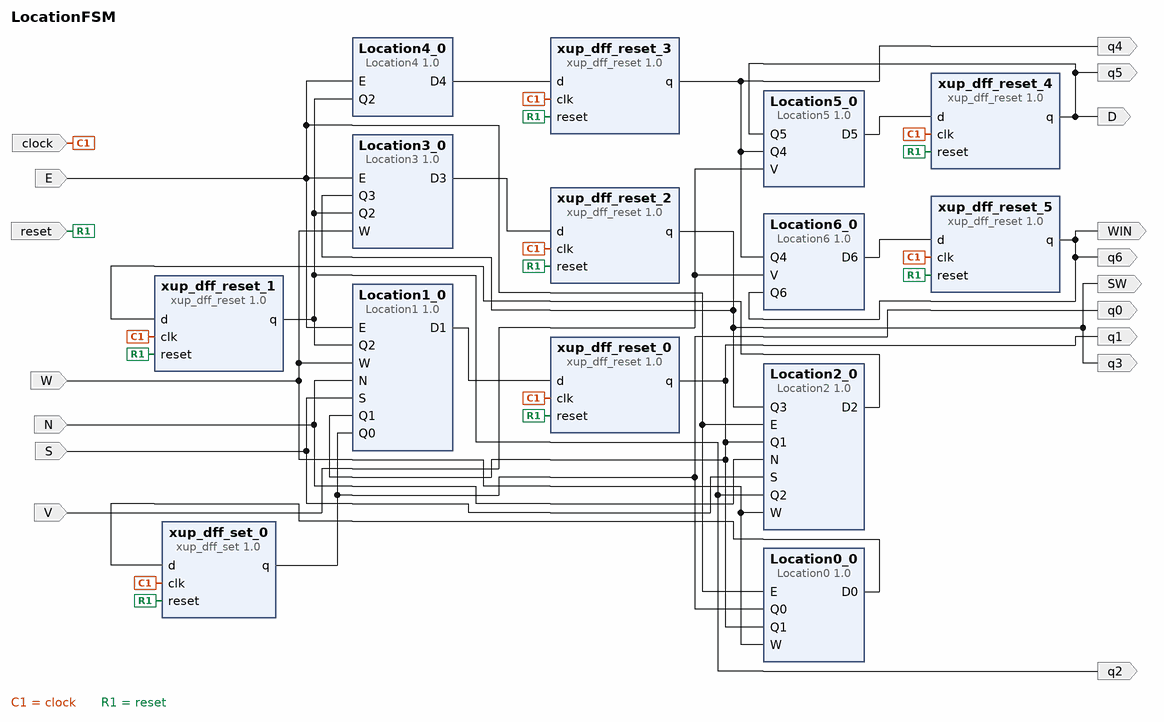
[diagram p0: block diagram of the top level]
# Vivado block design LocationFSM, xc7a100tcsg324-1, Vivado 2021.2
create_bd_design LocationFSM

create_bd_port -dir I E
create_bd_port -dir I N
create_bd_port -dir I S
create_bd_port -dir I W
create_bd_port -dir I V
create_bd_port -dir O q0
create_bd_port -dir O q1
create_bd_port -dir O q2
create_bd_port -dir O q3
create_bd_port -dir O SW
create_bd_port -dir O q4
create_bd_port -dir O q5
create_bd_port -dir O D
create_bd_port -dir O WIN
create_bd_port -dir O q6
create_bd_port -dir I clock
create_bd_port -dir I reset

create_bd_cell -type ip -vlnv xilinx.com:user:Location0:1.0 Location0_0
create_bd_cell -type ip -vlnv xilinx.com:user:Location1:1.0 Location1_0
create_bd_cell -type ip -vlnv xilinx.com:user:Location2:1.0 Location2_0
create_bd_cell -type ip -vlnv xilinx.com:user:Location3:1.0 Location3_0
create_bd_cell -type ip -vlnv xilinx.com:user:Location4:1.0 Location4_0
create_bd_cell -type ip -vlnv xilinx.com:user:Location5:1.0 Location5_0
create_bd_cell -type ip -vlnv xilinx.com:user:Location6:1.0 Location6_0
create_bd_cell -type ip -vlnv xilinx.com:user:xup_dff_reset:1.0 xup_dff_reset_0
create_bd_cell -type ip -vlnv xilinx.com:user:xup_dff_reset:1.0 xup_dff_reset_1
create_bd_cell -type ip -vlnv xilinx.com:user:xup_dff_reset:1.0 xup_dff_reset_2
create_bd_cell -type ip -vlnv xilinx.com:user:xup_dff_reset:1.0 xup_dff_reset_3
create_bd_cell -type ip -vlnv xilinx.com:user:xup_dff_reset:1.0 xup_dff_reset_4
create_bd_cell -type ip -vlnv xilinx.com:user:xup_dff_reset:1.0 xup_dff_reset_5
create_bd_cell -type ip -vlnv xilinx.com:user:xup_dff_set:1.0 xup_dff_set_0

# ---- connections ----

connect_bd_net [get_bd_ports E] \
  [get_bd_pins Location1_0/E] [get_bd_pins Location2_0/E] [get_bd_pins Location0_0/E] [get_bd_pins Location3_0/E] \
  [get_bd_pins Location4_0/E]
connect_bd_net [get_bd_pins Location0_0/D0] [get_bd_pins xup_dff_set_0/d]
connect_bd_net [get_bd_pins Location1_0/D1] [get_bd_pins xup_dff_reset_0/d]
connect_bd_net [get_bd_pins Location2_0/D2] [get_bd_pins xup_dff_reset_1/d]
connect_bd_net [get_bd_pins Location3_0/D3] [get_bd_pins xup_dff_reset_2/d]
connect_bd_net [get_bd_pins Location4_0/D4] [get_bd_pins xup_dff_reset_3/d]
connect_bd_net [get_bd_pins Location5_0/D5] [get_bd_pins xup_dff_reset_4/d]
connect_bd_net [get_bd_pins Location6_0/D6] [get_bd_pins xup_dff_reset_5/d]
connect_bd_net [get_bd_ports N] [get_bd_pins Location1_0/N] [get_bd_pins Location2_0/N]
connect_bd_net [get_bd_ports S] [get_bd_pins Location1_0/S] [get_bd_pins Location2_0/S]
connect_bd_net [get_bd_ports V] [get_bd_pins Location6_0/V] [get_bd_pins Location5_0/V]
connect_bd_net [get_bd_ports W] [get_bd_pins Location0_0/W] [get_bd_pins Location1_0/W] [get_bd_pins Location2_0/W] [get_bd_pins Location3_0/W]
connect_bd_net [get_bd_ports clock] \
  [get_bd_pins xup_dff_reset_0/clk] [get_bd_pins xup_dff_reset_1/clk] [get_bd_pins xup_dff_reset_2/clk] \
  [get_bd_pins xup_dff_reset_3/clk] [get_bd_pins xup_dff_reset_5/clk] [get_bd_pins xup_dff_set_0/clk] \
  [get_bd_pins xup_dff_reset_4/clk]
connect_bd_net [get_bd_ports reset] \
  [get_bd_pins xup_dff_reset_0/reset] [get_bd_pins xup_dff_reset_1/reset] [get_bd_pins xup_dff_reset_2/reset] \
  [get_bd_pins xup_dff_reset_3/reset] [get_bd_pins xup_dff_reset_5/reset] [get_bd_pins xup_dff_reset_4/reset] \
  [get_bd_pins xup_dff_set_0/reset]
connect_bd_net [get_bd_pins xup_dff_reset_0/q] \
  [get_bd_ports q1] [get_bd_pins Location2_0/Q1] [get_bd_pins Location1_0/Q1] [get_bd_pins Location0_0/Q1]
connect_bd_net [get_bd_pins xup_dff_reset_1/q] \
  [get_bd_ports q2] [get_bd_pins Location2_0/Q2] [get_bd_pins Location3_0/Q2] [get_bd_pins Location4_0/Q2] \
  [get_bd_pins Location1_0/Q2]
connect_bd_net [get_bd_pins xup_dff_reset_2/q] [get_bd_ports q3] [get_bd_pins Location3_0/Q3] [get_bd_pins Location2_0/Q3] [get_bd_ports SW]
connect_bd_net [get_bd_pins xup_dff_reset_3/q] [get_bd_ports q4] [get_bd_pins Location5_0/Q4] [get_bd_pins Location6_0/Q4]
connect_bd_net [get_bd_pins xup_dff_reset_4/q] [get_bd_ports q5] [get_bd_pins Location5_0/Q5] [get_bd_ports D]
connect_bd_net [get_bd_pins xup_dff_reset_5/q] [get_bd_ports WIN] [get_bd_ports q6] [get_bd_pins Location6_0/Q6]
connect_bd_net [get_bd_pins xup_dff_set_0/q] [get_bd_ports q0] [get_bd_pins Location1_0/Q0] [get_bd_pins Location0_0/Q0]

validate_bd_design
save_bd_design
